# Altium project Tuoi_cay.PrjPcb
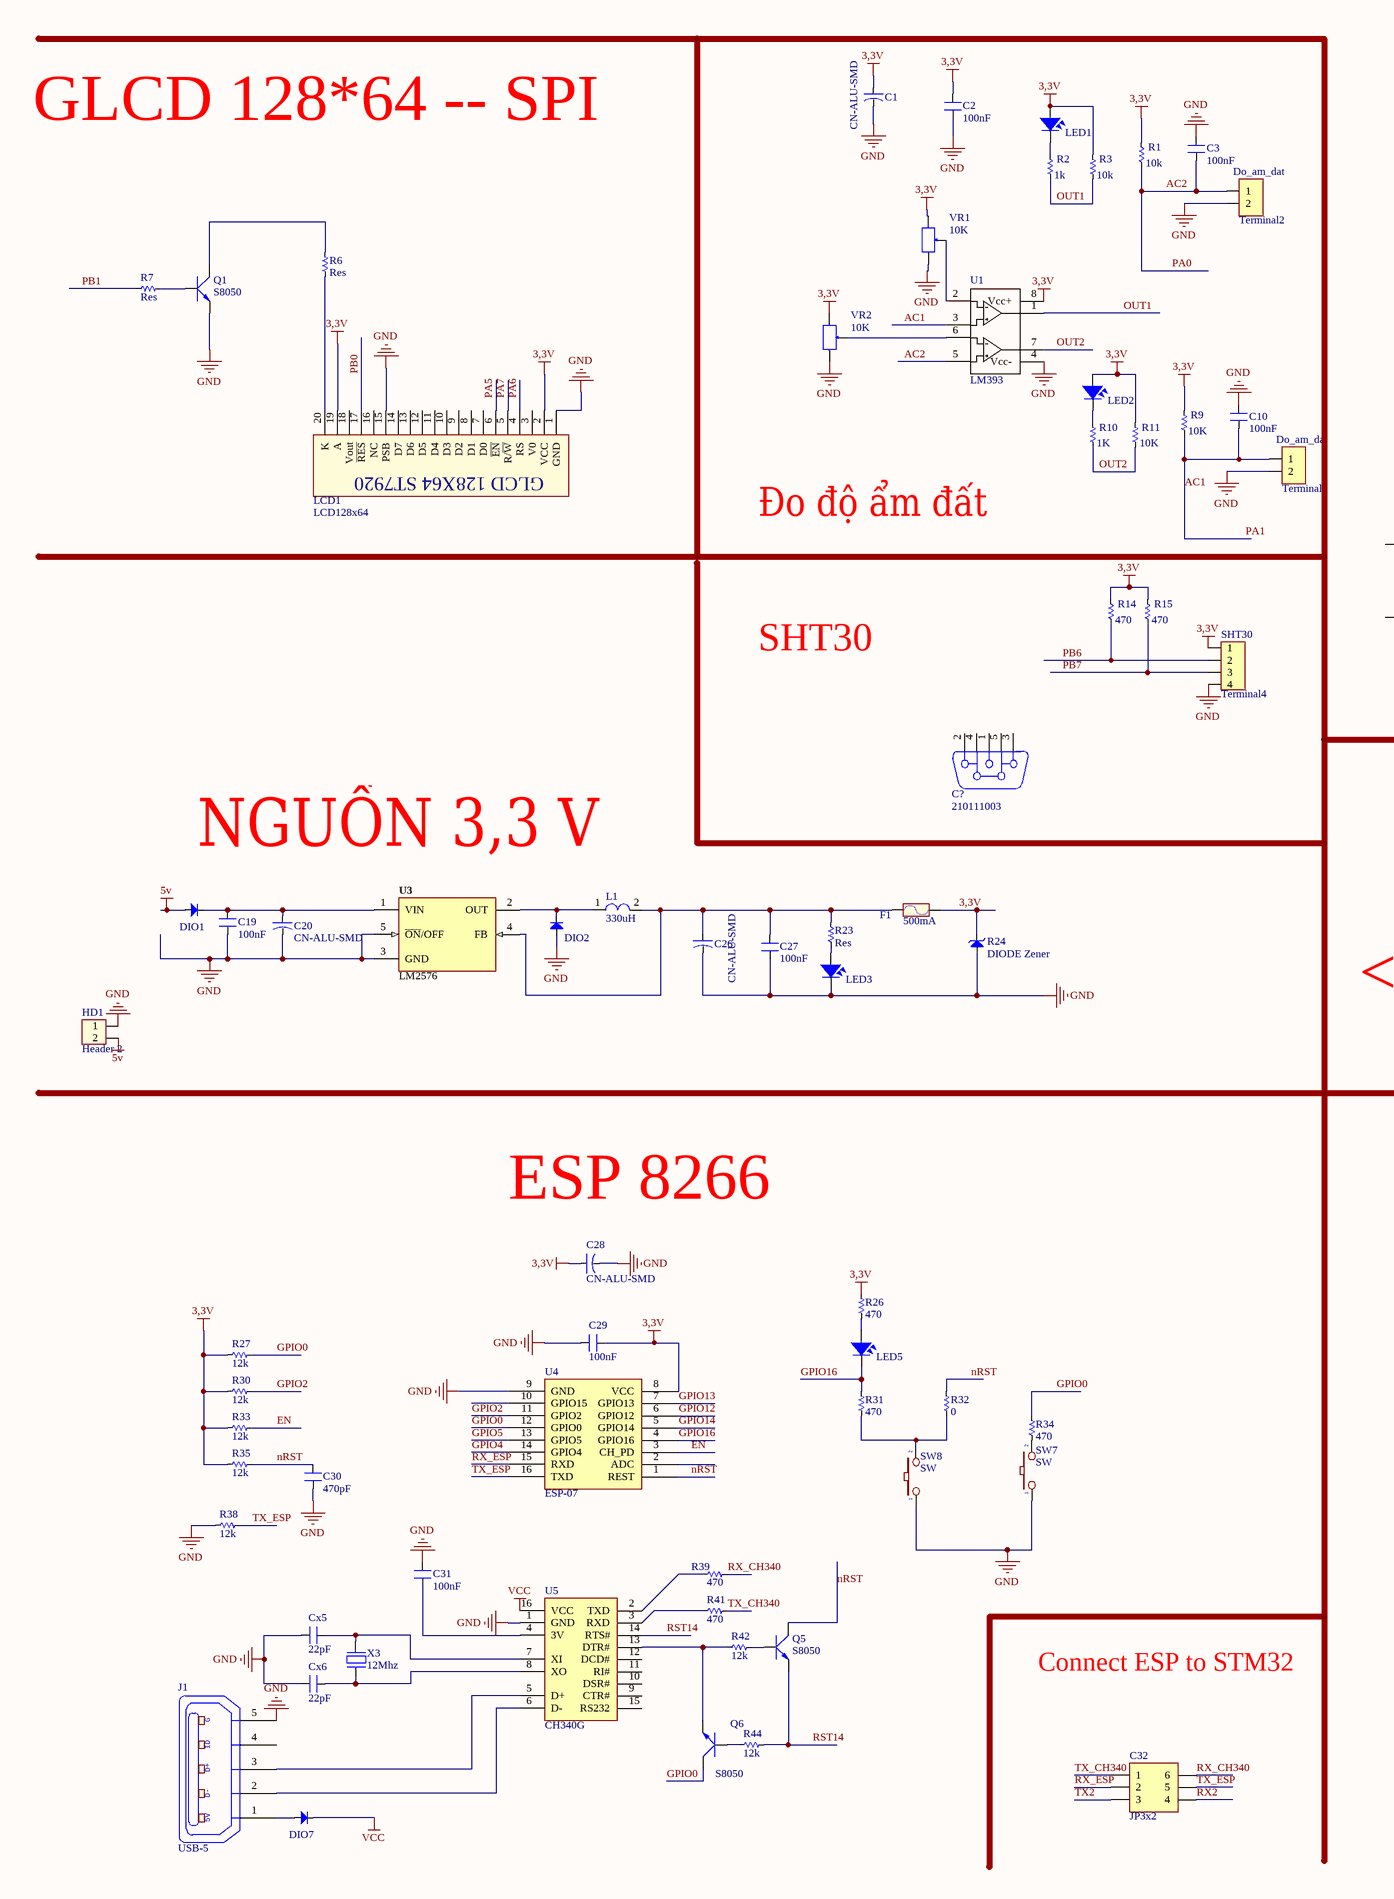
[diagram p0: tuoi_cay.SchDoc, left]
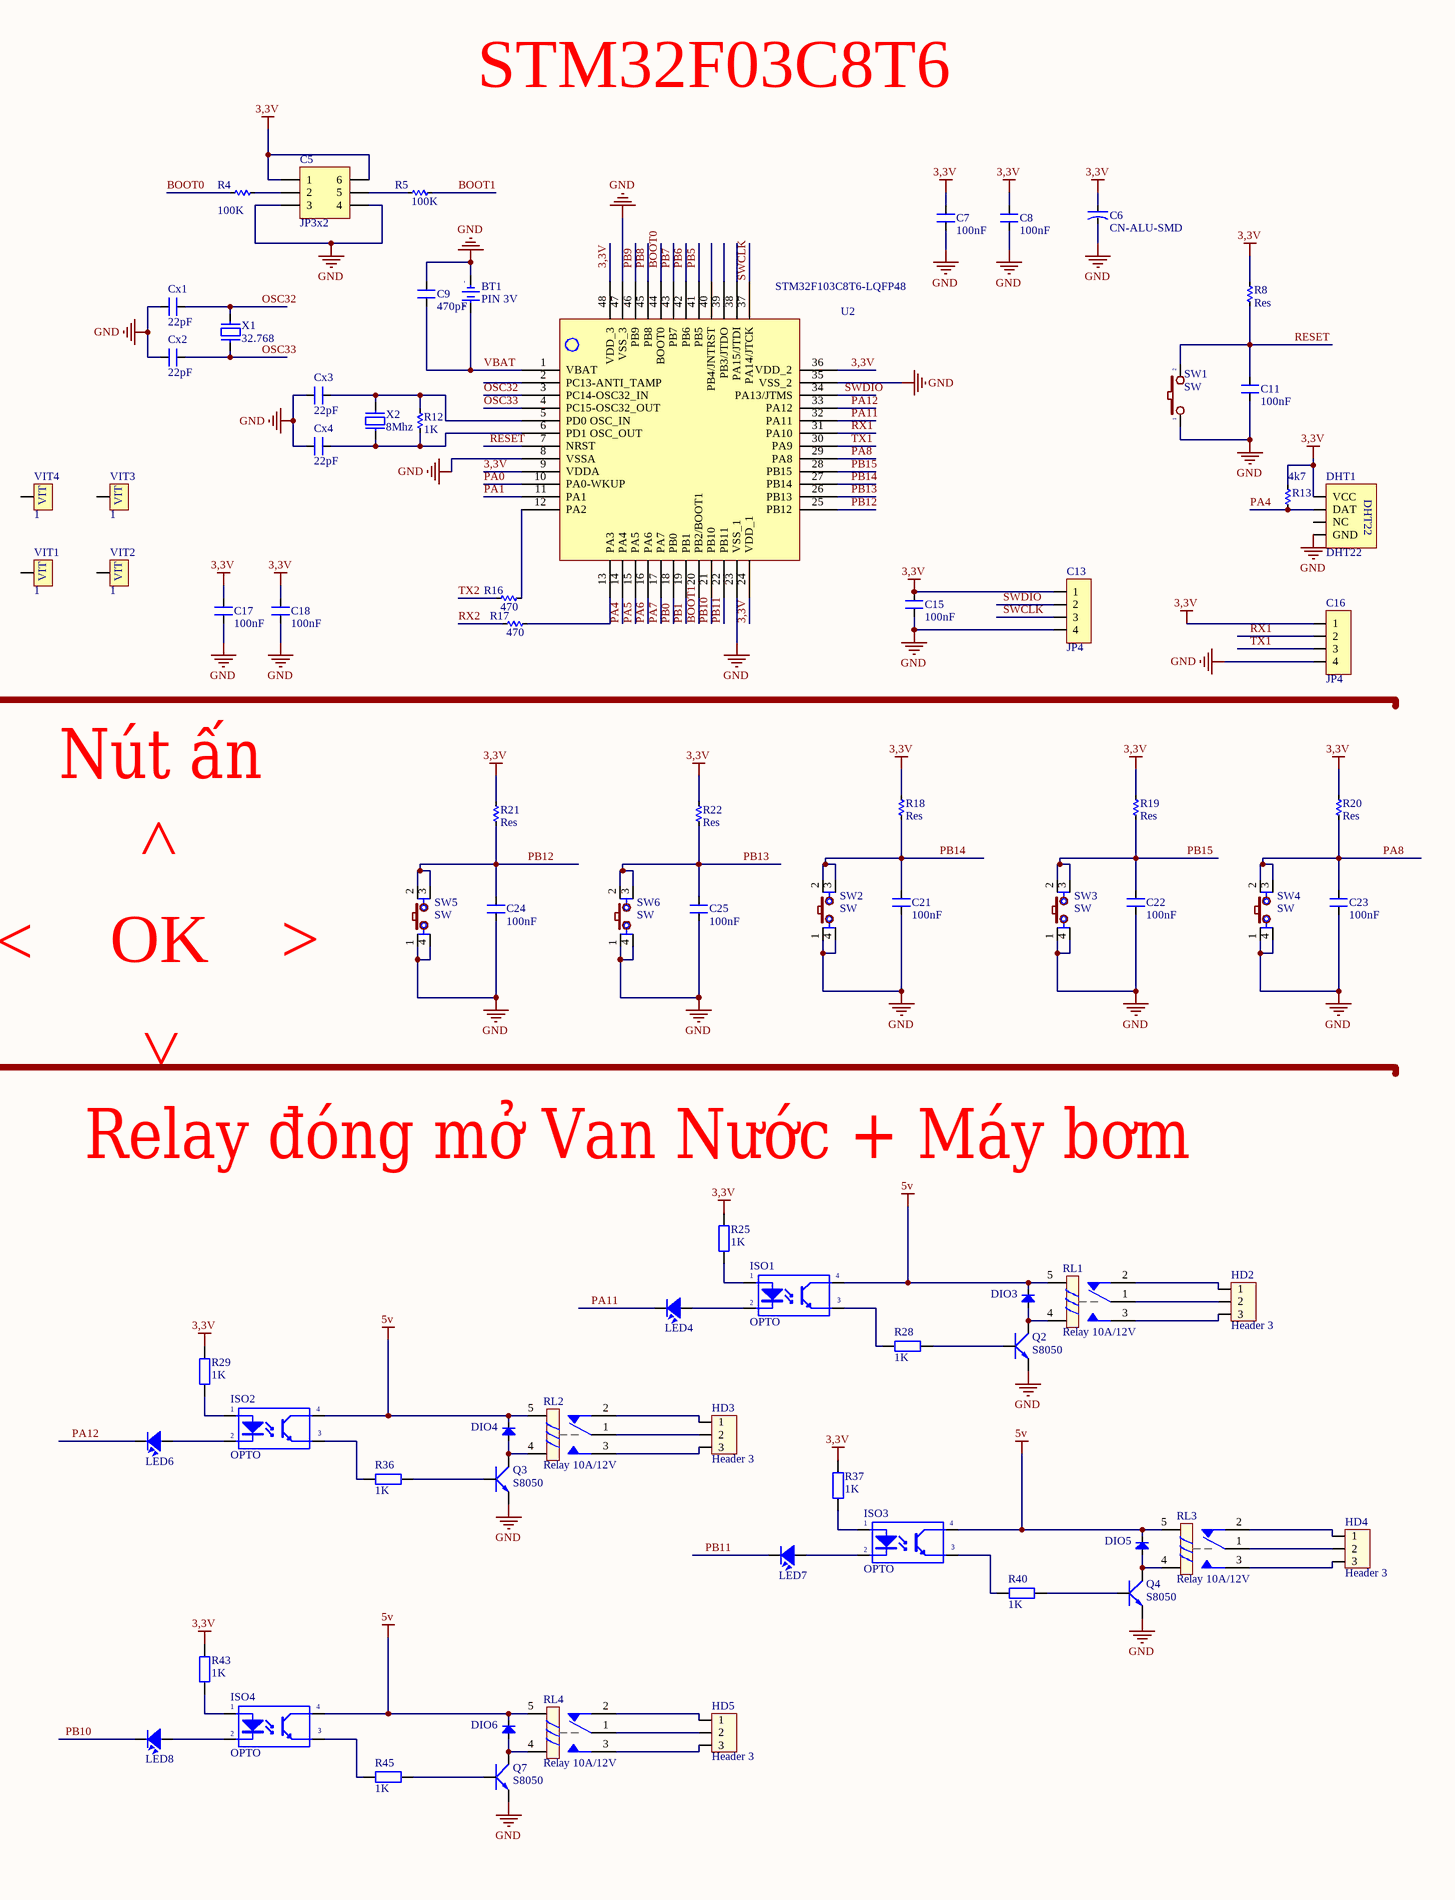
[diagram p1: tuoi_cay.SchDoc, right]
1 sheet, 147 parts. Net scope: global (net labels, ports and power ports of the same name join across sheets).
Board file: PCB1.PcbDoc

## Sheet tuoi_cay.SchDoc
size A2

### Parts
(Parts that share a designator on the sheet are numbered #1, #2 ... from top to bottom, then left to right.)
BT1  PIN 3V  [PIN3V]
C1  CN-ALU-SMD  [CAP-ALU-SMD-5.5x5.5]
C2  100nF  [SM-CAP-0805]
C3  100nF  [SM-CAP-0805]
C5  JP3x2  [JP3-D2T]
C6  CN-ALU-SMD  [CAP-ALU-SMD-5.5x5.5]
C7  100nF  [SM-CAP-0805]
C8  100nF  [SM-CAP-0805]
C9  470pF  [SM-CAP-0805]
C10  100nF  [SM-CAP-0805]
C11  100nF  [SM-CAP-0805]
C13  JP4  [JP4-C1T]
C15  100nF  [SM-CAP-0805]
C16  JP4  [JP4-C1T]
C17  100nF  [SM-CAP-0805]
C18  100nF  [SM-CAP-0805]
C19  100nF  [SM-CAP-0805]
C20  CN-ALU-SMD  [CAP-ALU-SMD-G]
C21  100nF  [SM-CAP-0805]
C22  100nF  [SM-CAP-0805]
C23  100nF  [SM-CAP-0805]
C24  100nF  [SM-CAP-0805]
C25  100nF  [SM-CAP-0805]
C26  CN-ALU-SMD  [CAP-ALU-SMD-G]
C27  100nF  [SM-CAP-0805]
C28  CN-ALU-SMD  [CAP-ALU-SMD-5.5x5.5]
C29  100nF  [SM-CAP-0805]
C30  470pF  [SM-CAP-0805]
C31  100nF  [SM-CAP-0805]
C32  JP3x2  [JP3-D2T]
C?  210111003  [SMA-ENDLAUNCH]
Cx1  22pF  [CN-SMD-0805]
Cx2  22pF  [CN-SMD-0805]
Cx3  22pF  [CN-SMD-0805]
Cx4  22pF  [CN-SMD-0805]
Cx5  22pF  [CN-SMD-0805]
Cx6  22pF  [CN-SMD-0805]
DHT1  DHT22  [DHT22]
DIO1  Diode SMD  [DIO-SMD-106]  (value not drawn)
DIO2  Diode SMD  [DIO-SMD-106]  (value not drawn)
DIO3  Diode SMD  [DIO-SMD-106]  (value not drawn)
DIO4  Diode SMD  [DIO-SMD-106]  (value not drawn)
DIO5  Diode SMD  [DIO-SMD-106]  (value not drawn)
DIO6  Diode SMD  [DIO-SMD-106]  (value not drawn)
DIO7  Diode SMD  [DIO-SMD-106]  (value not drawn)
Do_am_dat#1  Terminal2  [Terminal2]
Do_am_dat#2  Terminal2  [Terminal2]
F1  500mA  [RES-SMD-1206]
HD1  Header 2  [HED2]
HD2  Header 3  [HED3]
HD3  Header 3  [HED3]
HD4  Header 3  [HED3]
HD5  Header 3  [HED3]
ISO1  OPTO  [PC817 SMD]
ISO2  OPTO  [PC817 SMD]
ISO3  OPTO  [PC817 SMD]
ISO4  OPTO  [PC817 SMD]
J1  USB-5  [USB-M1]
L1  330uH  [L-SMD-M-12x10]
LCD1  LCD128x64  [ST7920]
LED1  LED  [LED-0805-Green]  (value not drawn)
LED2  LED  [LED-0805-Green]  (value not drawn)
LED3  LED  [LED-0805-Green]  (value not drawn)
LED4  LED  [LED-0805-Blue]  (value not drawn)
LED5  LED  [LED-0805-Blue]  (value not drawn)
LED6  LED  [LED-0805-Blue]  (value not drawn)
LED7  LED  [LED-0805-Blue]  (value not drawn)
LED8  LED  [LED-0805-Blue]  (value not drawn)
Q1  S8050  [SOT23-231]
Q2  S8050  [SOT23-231]
Q3  S8050  [SOT23-231]
Q4  S8050  [SOT23-231]
Q5  S8050  [SOT23-231]
Q6  S8050  [SOT23-231]
Q7  S8050  [SOT23-231]
R1  10k  [RES-SMD-0805]
R2  1k  [RES-SMD-0805]
R3  10k  [RES-SMD-0805]
R4  100K  [RES-SMD-0805]
R5  100K  [RES-SMD-0805]
R6  Res  [RES-SMD-0805]
R7  Res  [RES-SMD-0805]
R8  Res  [RES-SMD-0805]
R9  10K  [RES-SMD-0805]
R10  1K  [RES-SMD-0805]
R11  10K  [RES-SMD-0805]
R12  1K  [RES-SMD-0805]
R13  4k7  [RES-SMD-0805]
R14  470  [RES-SMD-0805]
R15  470  [RES-SMD-0805]
R16  470  [RES-SMD-0805]
R17  470  [RES-SMD-0805]
R18  Res  [RES-SMD-0805]
R19  Res  [RES-SMD-0805]
R20  Res  [RES-SMD-0805]
R21  Res  [RES-SMD-0805]
R22  Res  [RES-SMD-0805]
R23  Res  [RES-SMD-0805]
R24  DIODE Zener  [DIO-0.5A-SMALL]
R25  1K  [SM-0805]
R26  470  [RES-SMD-0805]
R27  12k  [RES-SMD-0805]
R28  1K  [SM-0805]
R29  1K  [SM-0805]
R30  12k  [RES-SMD-0805]
R31  470  [RES-SMD-0805]
R32  0  [RES-SMD-0805]
R33  12k  [RES-SMD-0805]
R34  470  [RES-SMD-0805]
R35  12k  [RES-SMD-0805]
R36  1K  [SM-0805]
R37  1K  [SM-0805]
R38  12k  [RES-SMD-0805]
R39  470  [RES-SMD-0805]
R40  1K  [SM-0805]
R41  470  [RES-SMD-0805]
R42  12k  [RES-SMD-0805]
R43  1K  [SM-0805]
R44  12k  [RES-SMD-0805]
R45  1K  [SM-0805]
RL1  Relay 10A/12V  [RELAY 5]
RL2  Relay 10A/12V  [RELAY 5]
RL3  Relay 10A/12V  [RELAY 5]
RL4  Relay 10A/12V  [RELAY 5]
SHT30  Terminal4  [Terminal]
SW1  SW  [SW1-SMD]
SW2  SW  [SW2-SMD]
SW3  SW  [SW2-SMD]
SW4  SW  [SW2-SMD]
SW5  SW  [SW2-SMD]
SW6  SW  [SW2-SMD]
SW7  SW  [SW1-SMD]
SW8  SW  [SW1-SMD]
U1  LM393  [SO8]
U2  STM32F103C8T6-LQFP48  [LQFP 48 PIN]
U3  LM2576  [TO263]
U4  ESP-07  [ESP8266-07]
U5  CH340G  [SO16]
VIT1  1  [VIT_type2]
VIT2  1  [VIT_type2]
VIT3  1  [VIT_type2]
VIT4  1  [VIT_type2]
VR1  10K  [VR-smd]
VR2  10K  [VR-smd]
X1  32.768  [XT32k]
X2  8Mhz  [XTAL-RU49/4]
X3  12Mhz  [XTAL-RU49/4]

### Nets
3,3V: C1.1 C2.2 C5.1 C5.6 C6.1 C7.2 C8.2 C13.1 C15.2 C16.1 C17.2 C18.2 C28.1 C29.1 DHT1.1(VCC) F1.2 LCD1.2(VCC) LCD1.19(A) LED1.1 LED2.1 R1.1 R3.1 R8.1 R9.1 R11.1 R13.1 R14.1 R15.1 R18.1 R19.1 R20.1 R21.1 R22.1 R24.2(K) R25.2 R26.1 R27.2 R29.2 R30.2 R33.2 R35.2 R37.2 R43.2 SHT30.1 U1.8(Vcc+) U2.9(VDDA) U2.24(VDD_1) U2.36(VDD_2) U2.48(VDD_3) U4.8(VCC) VR1.1 VR2.1
5v: DIO1.1(A) DIO3.2(K) DIO4.2(K) DIO5.2(K) DIO6.2(K) HD1.2 ISO1.4(C) ISO2.4(C) ISO3.4(C) ISO4.4(C) RL1.5 RL2.5 RL3.5 RL4.5
GND: BT1.2(GND) C1.2 C2.1 C3.2 C5.3 C5.4 C6.2 C7.1 C8.1 C9.2 C10.2 C11.1 C13.4 C15.1 C16.4 C17.1 C18.1 C19.1 C20.2 C21.1 C22.1 C23.1 C24.1 C25.1 C26.2 C27.1 C28.2 C29.2 C30.1 C31.2 Cx1.2 Cx2.2 Cx3.2 Cx4.1 Cx5.1 Cx6.1 DHT1.4(GND) DIO2.1(A) Do_am_dat#1.2 Do_am_dat#2.2 HD1.1 J1.5(P5) LCD1.1(GND) LCD1.15(PSB) LED3.2 Q1.1(E) Q2.1(E) Q3.1(E) Q4.1(E) Q7.1(E) R24.1(A) R38.2 SHT30.4 SW1.1 SW2.1 SW2.4 SW3.1 SW3.4 SW4.1 SW4.4 SW5.1 SW5.4 SW6.1 SW6.4 SW7.1 SW8.1 U1.4(Vcc-) U2.8(VSSA) U2.23(VSS_1) U2.35(VSS_2) U2.47(VSS_3) U3.3(GND) U3.5(~{ON}/OFF) U4.9(GND) U5.1(GND) VR1.3 VR2.3
VCC: DIO7.2(K) U5.16(VCC)
AC1: C10.1 Do_am_dat#2.1 R9.2 U1.3 U2.11(PA1)  [also labelled PA1]
AC2: C3.1 Do_am_dat#1.1 R1.2 U1.5 U2.10(PA0-WKUP)  [also labelled PA0]
BOOT0: R4.2 U2.44(BOOT0)
BOOT1: R5.1 U2.20(PB2/BOOT1)
EN: R33.1 U4.3(CH_PD)
GPIO0: Q6.3(C) R27.1 R34.1 U4.12(GPIO0)
GPIO2: R30.1 U4.11(GPIO2)
GPIO4: U4.14(GPIO4)
GPIO5: U4.13(GPIO5)
GPIO12: U4.6(GPIO12)
GPIO13: U4.7(GPIO13)
GPIO14: U4.5(GPIO14)
GPIO16: LED5.2 R31.1 U4.4(GPIO16)
nRST: C30.2 Q5.3(C) R32.1 R35.1 U4.1(REST)
OSC32: Cx1.1 U2.3(PC14-OSC32_IN) X1.2
OSC33: Cx2.1 U2.4(PC15-OSC32_OUT) X1.1
OUT1: R2.2 R3.2 U1.1
OUT2: R10.2 R11.2 U1.7
PA4: DHT1.2(DAT) R13.2 U2.14(PA4)
PA5: LCD1.6(~{EN}) U2.15(PA5)
PA6: LCD1.4(RS) U2.16(PA6)
PA7: LCD1.5(R/~{W}) U2.17(PA7)
PA8: C23.2 R20.2 SW4.2 SW4.3 U2.29(PA8)
PA11: LED4.2 U2.32(PA11)
PA12: LED6.2 U2.33(PA12)
PB0: LCD1.17(~{RES}) U2.18(PB0)
PB1: R7.2 U2.19(PB1)
PB5: U2.41(PB5)
PB6: R14.2 SHT30.2 U2.42(PB6)
PB7: R15.2 SHT30.3 U2.43(PB7)
PB8: U2.45(PB8)
PB9: U2.46(PB9)
PB10: LED8.2 U2.21(PB10)
PB11: LED7.2 U2.22(PB11)
PB12: C24.2 R21.2 SW5.2 SW5.3 U2.25(PB12)
PB13: C25.2 R22.2 SW6.2 SW6.3 U2.26(PB13)
PB14: C21.2 R18.2 SW2.2 SW2.3 U2.27(PB14)
PB15: C22.2 R19.2 SW3.2 SW3.3 U2.28(PB15)
RESET: C11.2 R8.2 SW1.2 U2.7(NRST)
RST14: Q5.1(E) R44.1 U5.14(RTS#)
RX1: C16.2 U2.31(PA10)
RX2: C32.4 R17.2
RX_CH340: C32.6 R39.1
RX_ESP: C32.2 U4.15(RXD)
SWCLK: C13.3 U2.37(PA14/JTCK)
SWDIO: C13.2 U2.34(PA13/JTMS)
TX1: C16.3 U2.30(PA9)
TX2: C32.3 R16.2
TX_CH340: C32.1 R41.1
TX_ESP: C32.5 R38.1 U4.16(TXD)
VBAT: BT1.1(+3V) C9.1 U2.1(VBAT)
NetC5_2: C5.2 R4.1
NetC5_5: C5.5 R5.2
NetC19_2: C19.2 C20.1 DIO1.2(K) U3.1(VIN)
NetC26_1: C26.1 C27.2 F1.1 L1.2 R23.1 U3.4(FB)
NetC31_1: C31.1 U5.4(3V)
NetCx3_1: Cx3.1 R12.1 U2.5(PD0_OSC_IN) X2.1
NetCx4_2: Cx4.2 R12.2 U2.6(PD1_OSC_OUT) X2.2
NetCx5_2: Cx5.2 U5.7(XI) X3.2
NetCx6_2: Cx6.2 U5.8(XO) X3.1
NetDIO2_2: DIO2.2(K) L1.1 U3.2(OUT)
NetDIO3_1: DIO3.1(A) Q2.3(C) RL1.4
NetDIO4_1: DIO4.1(A) Q3.3(C) RL2.4
NetDIO5_1: DIO5.1(A) Q4.3(C) RL3.4
NetDIO6_1: DIO6.1(A) Q7.3(C) RL4.4
NetDIO7_1: DIO7.1(A) J1.1(P1)
NetHD2_1: HD2.1 RL1.2
NetHD2_2: HD2.2 RL1.1
NetHD2_3: HD2.3 RL1.3
NetHD3_1: HD3.1 RL2.2
NetHD3_2: HD3.2 RL2.1
NetHD3_3: HD3.3 RL2.3
NetHD4_1: HD4.1 RL3.2
NetHD4_2: HD4.2 RL3.1
NetHD4_3: HD4.3 RL3.3
NetHD5_1: HD5.1 RL4.2
NetHD5_2: HD5.2 RL4.1
NetHD5_3: HD5.3 RL4.3
NetISO1_1: ISO1.1(A) R25.1
NetISO1_2: ISO1.2(K) LED4.1
NetISO1_3: ISO1.3(E) R28.2
NetISO2_1: ISO2.1(A) R29.1
NetISO2_2: ISO2.2(K) LED6.1
NetISO2_3: ISO2.3(E) R36.2
NetISO3_1: ISO3.1(A) R37.1
NetISO3_2: ISO3.2(K) LED7.1
NetISO3_3: ISO3.3(E) R40.2
NetISO4_1: ISO4.1(A) R43.1
NetISO4_2: ISO4.2(K) LED8.1
NetISO4_3: ISO4.3(E) R45.2
NetJ1_2: J1.2(P2) U5.6(D-)
NetJ1_3: J1.3(P3) U5.5(D+)
NetLCD1_20: LCD1.20(K) R6.2
NetLED1_2: LED1.2 R2.1
NetLED2_2: LED2.2 R10.1
NetLED3_1: LED3.1 R23.2
NetLED5_1: LED5.1 R26.2
NetQ1_2: Q1.2(B) R7.1
NetQ1_3: Q1.3(C) R6.1
NetQ2_2: Q2.2(B) R28.1
NetQ3_2: Q3.2(B) R36.1
NetQ4_2: Q4.2(B) R40.1
NetQ5_2: Q5.2(B) R42.1
NetQ6_1: Q6.1(E) R42.2 U5.13(DTR#)
NetQ6_2: Q6.2(B) R44.2
NetQ7_2: Q7.2(B) R45.1
NetR16_1: R16.1 U2.12(PA2)
NetR17_1: R17.1 U2.13(PA3)
NetR31_2: R31.2 R32.2 SW8.2
NetR34_2: R34.2 SW7.2
NetR39_2: R39.2 U5.2(TXD)
NetR41_2: R41.2 U5.3(RXD)
NetU1_2: U1.2 VR1.2
NetU1_6: U1.6 VR2.2

Not connected (* = marked no-connect by the designer): C? 1 2 3 4 5; DHT1 3(NC); J1 4(P4); LCD1 3(V0) 7(D0) 8(D1) 9(D2) 10(D3) 11(D4) 12(D5) 13(D6) 14(D7) 16(NC) 18(Vout); U2 2(PC13-ANTI_TAMP) 38(PA15/JTDI) 39(PB3/JTDO) 40(PB4/JNTRST); U4 2(ADC) 10(GPIO15); U5 9(CTR#) 10(DSR#) 11(RI#) 12(DCD#) 15(RS232); VIT1 1(VIT); VIT2 1(VIT); VIT3 1(VIT); VIT4 1(VIT)

### Notes on the sheet
- GLCD 128*64 -- SPI
- STM32F03C8T6
- Đo độ ẩm đất
- SHT30
- Nút ấn
- NGUỒN 3,3 V
- >
- OK
- Relay đóng mở Van Nước + Máy bơm
- ESP 8266
- Connect ESP to STM32
- (in symbol LCD128x64) GLCD 128X64 ST7920
- (in symbol PIN 3V) -; +
- (in symbol USB-5) G; ID; D+; D-; 5V

### Library data of the parts
C1 C6 C20 C26 C28 = CN-ALU-SMD: Polarized Capacitor (Axial); Published: 8-Jun-2000; LatestRevisionDate: 17-Jul-2002; LatestRevisionNote: Re-released for DXP Platform.; PackageReference: POLAR0.8; Publisher: Altium Limited
C2 C3 C7-C11 C15 C17-C19 C21-C25 C27 C29-C31 = CN: Value: 0,1uF/300V; Designed by: VanDungEvn
C5 C32 = JP3x2: WR-PHD 2.54 mm Dual Socket Header; Manufacturer: W¨¹rth Elektronik eiSos GmbH; partNo: 61300621821; ComponentLink1 Description: Manufacturer; ComponentLink2 Description: Datasheet; NoPins: 06; Created Date: 29 March 2013; ComponentLink1URL: http://www.we-online.com; ComponentLink2URL: http://katalog.we-online.de/em/datasheet/6130xx21821.pdf; Created by: Karrer Zheng
C13 C16 = JP4: WR-PHD 2.54 mm Angled Socket Header; Manufacturer: W¨¹rth Elektronik eiSos GmbH; partNo: 613004143121; ComponentLink1 Description: Manufacturer; ComponentLink2 Description: Datasheet; NoPins: 04; Created Date: 29 March 2013; ComponentLink1URL: http://www.we-online.com; ComponentLink2URL: http://katalog.we-online.de/em/datasheet/6130xx143121.pdf; Created by: Karrer Zheng
C? = CON Ant: CONNECTOR ANTEN; Manufacturer: Würth Elektronik eiSos GmbH; partNo: 210111003; ComponentLink1Description: Manufacturer; ComponentLink1URL: http://www.we-online.de; Created by: Christin Zierenner; Created Date: May 2012; ComponentLink2Description: Datasheet; ComponentLink2URL: http://katalog.we-online.de/kataloge/eisos/index.php?language=en&pf=Filter_gerade
Cx1-Cx6 = CN: Value: 33pF
DHT1 = DHT22: Manufacturer: W¨¹rth Elektronik eiSos GmbH; partNo: 613004143121; ComponentLink1 Description: Manufacturer; ComponentLink2 Description: Datasheet; NoPins: 04; Created Date: 29 March 2013; ComponentLink1URL: http://www.we-online.com; ComponentLink2URL: http://katalog.we-online.de/em/datasheet/6130xx143121.pdf; Created by: Karrer Zheng
DIO1-DIO7 = Diode SMD: Default Diode; Code - JEDEC: DO-214-AB; Value: 1N5007; Published: 8-Jun-2000; Revision: July-2002: Re-released for DXP Platform.; Publisher: Altium Limited
F1 = Fuse: Designed by: VanDungEvn; Value: Fuse
HD1 = Hed2: Header 2 (Green); Value: Header 2
HD2-HD5 = Hed3: Header 3 (Green); Value: Header 3
ISO1-ISO4 = OPTO: Value: TLP5211
J1 = USB-5: Manufacturer: FCI; Manufacturer Part Number: 10118193-0001LF; Connector Type: USB - micro B; Number of Contacts: 5; Gender: Receptacle; Specifications: USB 2.0; .Creator: MM; .Checked PCB: RF; Supplier 1: Digi-Key; RoHS: RoHS Compliant; Category: Connectors, Interconnects; Stock 1: 28642; Pricing 1: 1=0.46, 10=0.433, 25=0.3712, 50=0.3156, 100=0.3032, 250=0.27224, 500=0.25988 (USD); Packaging: Cut Tape (CT); Mounting Type: Surface Mount, Right Angle, Horizontal; Features: Shielded, Solder Retention; Ingress Protection: -; ComponentLink1URL: http://portal.fciconnect.com/Comergent//fci/drawing/10118193.pdf; ComponentLink1Description: http://portal.fciconnect.com/Comergent//fci/drawing/10118193.pdf; Supplier Part Number 1: 609-4616-1-ND; .Checked SCH: MM
L1 = L-SMD-1: partNo: 78477010; Manufacturer: Wurth Elektronik; Inductance: 1.0 μH; ComponentLink1Description: Manufacturer; ComponentLink1URL: http://www.we-online.de; Created by: Baojun Chen; Created Date: Nov.2015; ComponentLink2Description: Datasheet; ComponentLink2URL: http://katalog.we-online.de/pbs/datasheet/78477010.pdf
LCD1 = LCD128x64: LCD Graphic 128x64; Value: LCD 128x64
LED1-LED8 = LED SMD: Value: LED 3 - 5 ly 2 Colour
Q1-Q7 = 2N222: NPN 600mW, ECB; Value: C1815
R1-R23 R26 R27 R30-R35 R38 R39 R41 R42 R44 = Res-SMD: Resistor; Manufacturer: Generic Components; Class: Passive; Published: 08/06/2000; Publisher: Altium Hobart Technology Centre
R24 = DIODE Zener: Zenner
R25 R28 R29 R36 R37 R40 R43 R45 = RM: Resistor SMD; Value: 1K
RL1-RL4 = Relay 5: Relay SPDT,10A - 12VDC 5 Pin; Value: Relay SPDT, 10A, 12V
SHT30 = Terminal4: Header IDC, 4 x 1 Pin Vertical 2.54mm Pitch (Non-Boxed, Male); Manufacturer: W¨¹rth Elektronik eiSos GmbH; partNo: 613002143121; ComponentLink1 Description: Manufacturer; ComponentLink2 Description: Datasheet; NoPins: 02; Created Date: 29 March 2013; ComponentLink1URL: http://www.we-online.com; ComponentLink2URL: http://katalog.we-online.de/em/datasheet/6130xx143121.pdf; Created by: Karrer Zheng
SW1 SW7 SW8 = SW2: Switch button 2 pin; Value: SW chip 2 pin
SW2-SW6 = SW4: Switch button 4 pin; Value: Button chip 4 pin
U1 = LM393: IC DUAL COMPARATOR
U3 = LM2576: Max Input Voltage: 12 V; Max Output Current: 3 (6.0 peak) A; Max Output Voltage: mV; Category: IC-Power; Min Input Voltage: mV; Min Output Voltage: mV; Mounting Technology: Surface Mount; Status: Unreleased; Supply Voltage: mV; Temperature Range: -40 to +125 degC
U5 = CH340G: High and Low Side Driver; Note: Pins 4, 8 and 14 are not connected; Published: 8-Jun-2000; LatestRevisionDate: 04-Mar-2005; LatestRevisionNote: Stylized 3D Model Added.; DatasheetVersion: PD60147J; PackageReference: PDIP14; Publisher: Altium Limited; PackageDescription: DIP; 14 Leads; Row Spacing 7.62 mm; Pitch 2.54 mm; ComponentLink1Description: Manufacturer Link; ComponentLink1URL: http://www.irf.com/; ComponentLink2Description: Datasheet; ComponentLink2URL: http://www.irf.com/product-info/datasheets/data/ir2110.pdf
VIT1-VIT4 = VIT: Oc Vit
VR1 VR2 = VR: Var Resistor; Value: VR 10K
X1-X3 = XT2: Crystal, 32.768 KHz, -40 to 85 degC, 3.2 x 1.5 x 0.9 mm SMD; Value: 4Mhz
BT1 = PIN 3V: Value: PIN 3V
U2 = STM32F103C8T6-LQFP48: Published: 30-May-2008; DatasheetVersion: rev6, Mar-2008; PackageVersion: Mar-2008; PackageReference: LQFP48; Publisher: Altium Limited; PackageDescription: 48-Pin Low-Profile Quad Flat Pack, 7 x 7 mm Body, 0.5 mm Pitch (LQFP48); ComponentLink1Description: Manufacturer Link; ComponentLink1URL: www.st.com/stm32; ComponentLink2Description: Datasheet; ComponentLink2URL: http://www.st.com/stonline/products/literature/ds/13586.pdf